# Altium project Nuclear_Briefcase.PrjPcb
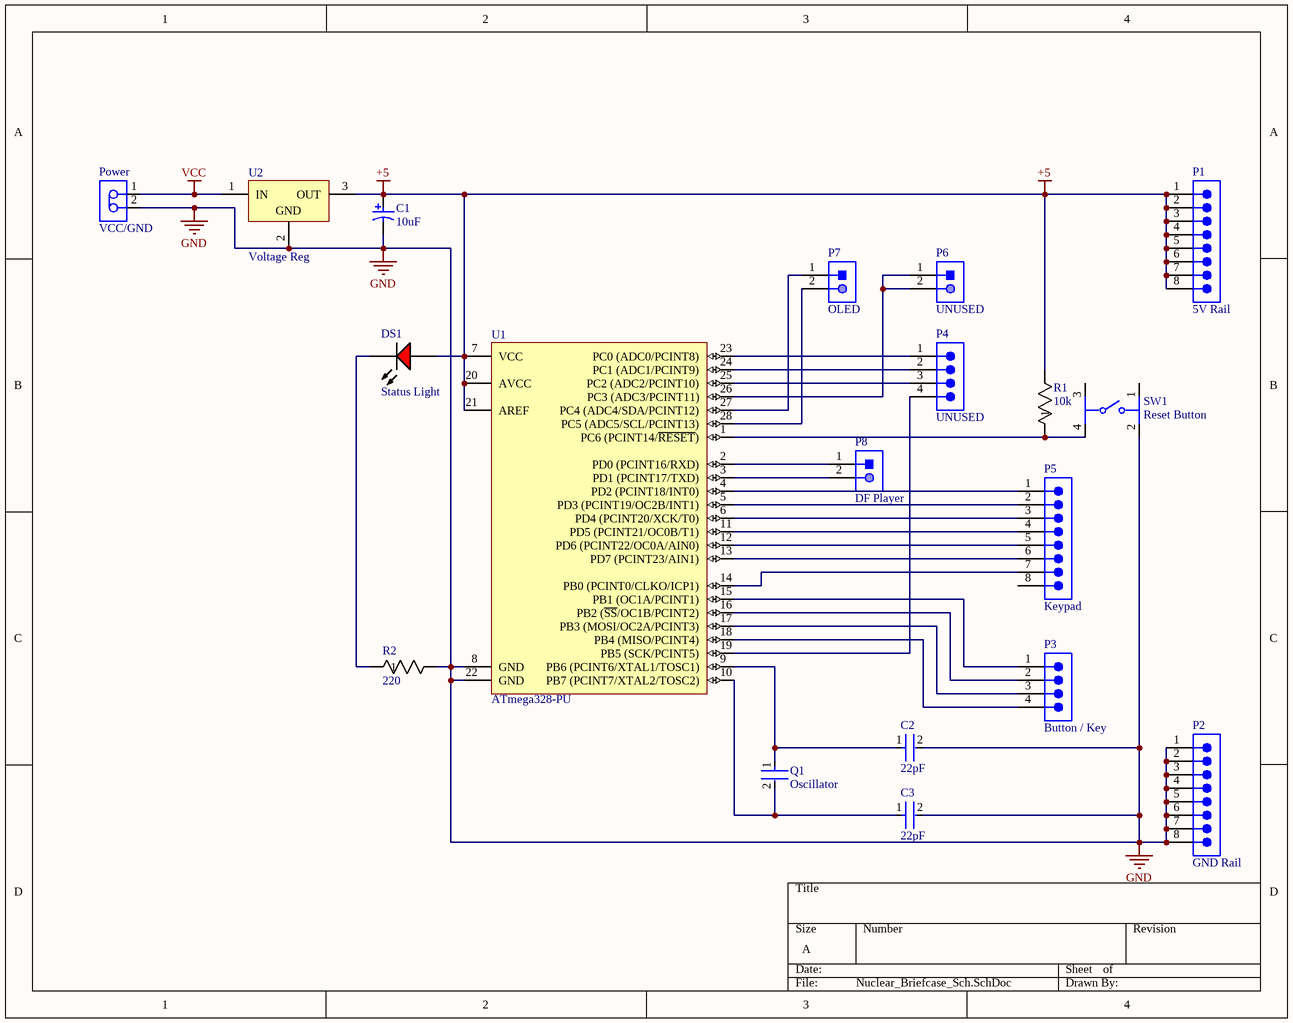
[diagram p0: Nuclear_Briefcase_Sch.SchDoc]
1 sheet, 19 parts. Net scope: global (net labels, ports and power ports of the same name join across sheets).

## Sheet Nuclear_Briefcase_Sch.SchDoc
size A; SheetNumber: 1; SheetTotal: 1

### Parts
C1  10uF  [CAPPR55-200-1100X500X1200]
C2  22pF  [FP-RCE0DB-MFG]
C3  22pF  [FP-RCE0DB-MFG]
DS1  Status Light  [LED-2P-2.28-3MM_A]
P1  5V Rail  [691321300008]
P2  GND Rail  [691321300008]
P3  Button / Key  [61300411121]
P4  UNUSED  [61300411121]
P5  Keypad  [691321300008]
P6  UNUSED  [JST-S2B-XH-A(LF)(SN)_V]
P7  OLED  [JST-S2B-XH-A(LF)(SN)_V]
P8  DF Player  [JST-S2B-XH-A(LF)(SN)_V]
Power  VCC/GND  [TECO-640456-2_V]
Q1  Oscillator  [FP-RCE0DB-MFG]
R1  10k  [RES_AC07_VIS]
R2  220  [RES_AC05_VIS]
SW1  Reset Button  [FP-PTS645SM43SMTR92LFS-MFG]
U1  ATmega328-PU  [28P3]
U2  Voltage Reg  [TO220]

### Nets
+5: C1.1 DS1.1(A) P1.1 P1.2 P1.3 P1.4 P1.5 P1.6 P1.7 P1.8 R1.2 U1.7(VCC) U1.20(AVCC) U1.21(AREF) U2.3(OUT)
GND: C1.2 C2.2 C3.2 P2.1 P2.2 P2.3 P2.4 P2.5 P2.6 P2.7 P2.8 Power.2 R2.2 SW1.2 U1.8(GND) U1.22(GND) U2.2(GND)
VCC: Power.1 U2.1(IN)
NetC2_1: C2.1 Q1.1 U1.9(PB6_(PCINT6/XTAL1/TOSC1))
NetC3_1: C3.1 Q1.2 U1.10(PB7_(PCINT7/XTAL2/TOSC2))
NetDS1_2: DS1.2(K) R2.1
NetP3_1: P3.1 U1.15(PB1_(OC1A/PCINT1))
NetP3_2: P3.2 U1.16(PB2_(~{SS}/OC1B/PCINT2))
NetP3_3: P3.3 U1.17(PB3_(MOSI/OC2A/PCINT3))
NetP3_4: P3.4 U1.18(PB4_(MISO/PCINT4))
NetP4_1: P4.1 U1.23(PC0_(ADC0/PCINT8))
NetP4_2: P4.2 U1.24(PC1_(ADC1/PCINT9))
NetP4_3: P4.3 U1.25(PC2_(ADC2/PCINT10))
NetP4_4: P4.4 U1.19(PB5_(SCK/PCINT5))
NetP5_1: P5.1 U1.4(PD2_(PCINT18/INT0))
NetP5_2: P5.2 U1.5(PD3_(PCINT19/OC2B/INT1))
NetP5_3: P5.3 U1.6(PD4_(PCINT20/XCK/T0))
NetP5_4: P5.4 U1.11(PD5_(PCINT21/OC0B/T1))
NetP5_5: P5.5 U1.12(PD6_(PCINT22/OC0A/AIN0))
NetP5_6: P5.6 U1.13(PD7_(PCINT23/AIN1))
NetP5_7: P5.7 U1.14(PB0_(PCINT0/CLKO/ICP1))
NetP6_1: P6.1 P6.2 U1.26(PC3_(ADC3/PCINT11))
NetP7_1: P7.1 U1.27(PC4_(ADC4/SDA/PCINT12))
NetP7_2: P7.2 U1.28(PC5_(ADC5/SCL/PCINT13))
NetP8_1: P8.1 U1.2(PD0_(PCINT16/RXD))
NetP8_2: P8.2 U1.3(PD1_(PCINT17/TXD))
NetR1_1: R1.1 SW1.4 U1.1(PC6_(PCINT14/~{RESET}))

Not connected (* = marked no-connect by the designer): P5 8; SW1 1 3

### Library data of the parts
C1 = CMP-1665-00038-2: Aluminum Electrolytic Capacitor, 10 uF, +/- 20%, 50 V, -40 to 85 degC, 2-Pin THD, RoHS, Bulk; Manufacturer: Panasonic; Life (Hours): 2000Hour; Lead/Base Style: Straight; Dissipation Factor: 0.12%; Leakage Current: 3uA; Dielectric Material: Aluminium; Lead Diameter: 0.5mm; Voltage Rating: 50V; Ripple Current: 65mA; Package Reference: CAPPR55-200-1100X500X1200; Height: 11mm; Diameter: 5mm; REACH SVHC: NoSVHC; Mount: ThroughHole; Packaging: Bulk; Manufacturer URL: http://www.panasonic.com/; Capacitance: 10uF; Termination: Radial; Datasheet URL: https://industrial.panasonic.com/cdbs/www-data/pdf/RDF0000/ABA0000C1218.pdf; Lead Free: LeadFree; Height - Seated (Max): 0.472inch; Case/Package: Radial; Package Description: 2-Pin Radial Lead, Dia 5 mm, Height 12 mm; Tolerance: 20%; Datasheet Version: Rev. 05, 10/2016; Package Quantity: 200; Ripple Current (AC): 65mA; Min Operating Temperature: -40degC; RoHSCompliant: true; Number of Pins: 2; Max Operating Temperature: 85degC; Voltage: 50V; Lead Pitch: 2mm; Radiation Hardening: No; Voltage Rating (DC): 50V; Length: 11mm
C2 C3 Q1 = CMP-06035-047347-1: Cap Ceramic 22pF 100V C0G ±5% Radial 2.5mm +125°C Ammo Pack; Lead Diameter: 0.5mm; Lead/Base Style: Straight; Height: 3.5mm; Voltage: 100V; Mount: Through Hole; Min Operating Temperature: -55°C; Height - Seated (Max): 0.138inch; Dielectric: C0G; Width: 0.098inch; Depth: 2.5mm; Lead Pitch: 0.098inch; Packaging: Tape and Reel; Voltage Rating (DC): 100V; Capacitance: 22pF; Package Quantity: 2000; Max Operating Temperature: 125°C; Tolerance: 5%; Termination: Radial; Voltage Rating: 100V; Case/Package: Radial; Resistor Type: Ceramic; Length: 3.6mm; Ratings: AEC-Q200
DS1 = CMP-007-00007-2: Red LED, 80 mW, 30 mA, -25 to 85 degC, 2-Pin THD; Manufacturer: Shenzhen CGX; Package Description: 2-Pin Through Hole Device, Dia 3 mm, Pitch 2.28 mm; Datasheet URL: http://datasheet.octopart.com/304090041-Chengguangxing-datasheet-62330656.pdf; Mounting Technology: TH; Manufacturer URL: http://szcgx.com/; RoHS Compliant: Unknown; Datasheet Version: Sep-14; Case/Package: 304090041; Package Reference: 304090041
P1 P2 P5 = CMP-002-00073-1: Barrier Strip Terminal Block, 10A, 1 Row(s), 1 Deck(s); Manufacturer Series: 321; Terminal and Terminal Block Type: BARRIER STRIP TERMINAL BLOCK; RoHS Compliant: Yes; Reach SVHC Compliant: Yes
P3 P4 = CMP-002-00093-1: Board Connector, 4 Contact(s), 1 Row(s), Male, Straight, 0.1 inch Pitch, Solder Terminal, Locking, Black Insulator, Plug; Body Length: 0.4inch; Rated Current (Signal): 3A; Number of Rows Loaded: 1; Reliability: COMMERCIAL; Contact Style: SQ PIN-SKT; Contact Resistance: 20mR; Dielectric Withstanding Voltage (AC): 500V; Contact Pattern: RECTANGULAR; Reference Standard: UL; Insulation Resistance: 1GR; Number of Contacts: 4; Insulation Color: Black; Contact Gender: Male; Mounting Style: STRAIGHT; Body Depth: 0.1inch; Min Operating Temperature: -40°C; Contact Material: Copper Alloy; Number Of Connectors: 1; Mounting Technology: Board; Connector Type: BOARD CONNECTOR; Max Operating Temperature: 125°C; Body/Shell Style: PLUG; Reach SVHC Compliant: Yes; JESD-609 Code: e4; Terminal Pitch: 2.54mm; Contact Finish - Mating: GOLD; Body Breadth: 0.1inch; Mating Contact Pitch: 0.1inch; Terminal Length: 0.118inch; Insulation Material: Polybutylene; Contact Finish - Termination: Gold (Au) - with Nickel (Ni) barrier; Mounting Option 1: LOCKING; PCB Contact Pattern: RECTANGULAR; RoHS Compliant: Yes; Termination: Solder
P6-P8 = CMP-002-00032-2: Male Header, Pitch 2.5 mm, 1 x 2 Position, Height 6.1 mm, Tail Length 3.4 mm, -25 to 85 degC, RoHS, Bulk; Manufacturer: JST; Case/Package: S2B-XH-A(LF)(SN); Package Description: XH Series Disconnectable Crimp Style Connector, Pitch 2.5 mm, 1 x 2 Position, Height 6.1 mm, Tail Length 3.4 mm; Manufacturer URL: http://www.jst.com/home2.html; Datasheet URL: http://www.jst-mfg.com/product/pdf/eng/eXH.pdf; Connector Type: Header; Package Reference: S2B-XH-A(LF)(SN); Mounting Technology: TH; Max Operating Temperature: 85°C; Min Operating Temperature: -25°C; Datasheet Version: May-16; Gender: Male; RoHS Compliant: Unknown
Power = CMP-2000-05417-1: Male Header, Pitch 2.54 mm, 1 x 2 Position, Height 10.49 mm, Tail Length 3.556 mm, -55 to 105 degC, RoHS, Bulk; Manufacturer: TE Connectivity; Standards: RoHSCompliant,ELVCompliant,UL94V-0; Material, Housing: Polyester; Agency Approvals: CSA,UL; Brand/Series: MTA-100Series; Contact Centerline Spacing: 0.100 / in.; Material, Contact: CopperAlloy; Current, Rating: 5 / A; Color, Housing: White; Contact Termination Area Plating: Tin; Special Features: Pinstrip; Number of Positions: 2; Pin Spacing: 0.1 / "; Temperature, Operating: -55to+105 / degC; Angle: Straight; Mount Angle: Vertical; Connector Type: MTA-100; Primary Type: InterconnectSystem; Voltage, Rating: 250 / V; Mounting Hole Size: 0.04 / "; Number of Rows: 1; Termination: Solder; Length, Terminal Post: 0.14 / in.; Manufacturer URL: http://www.te.com/; Color: White; Size, Post: 0.025 / in.; Contact Shape: Square; Mounting Type: PCMount; Datasheet URL: https://datasheet.ciiva.com/11746/0900766b80eb7fdd-11746365.pdf; Type: PCBPlug; Datasheet Version: Rev. W, 06/2004; Number of Contacts: 2; Flammability Rating: UL94V-0; Contact Plating: Tin; Length, Pin: 0.14 / "; Contact Mating Area Plating: Tin; Length, Overall: 0.2 / "
R1 = CMP-00030-42824152-1: AC07000001002JAC00 Resistor, 10 kOhm, ± 5%, 7 W, Axial Leaded, Wirewound, General Purpose; Voltage Rating (DC): 265V; Power Rating: 7W; Temperature Coefficient: 180ppm/°C; Resistance: 10kΩ; Composition: Wirewound; NexarPartId: 42824152; Thickness: 7.493mm; Number of Terminations: 2; Schedule B: 8533210080, 8533210080; Tolerance: 5%; Case/Package: Axial; RoHS: Compliant; Features: Flame Retardant Coating; Max Power Dissipation: 7W; Termination: Axial; Diameter: 7.5mm; Military Standard: Not; Contact Plating: Tin; Max Operating Temperature: 200°C; Width: 7.49mm; Packaging: Tape & Box (TB); Length: 26mm; Number of Pins: 2; Voltage Rating: 265V; Min Operating Temperature: -40°C; REACH SVHC: Unknown
R2 = CMP-00030-39746845-1: AC05000002200JAC00 Resistor, 220 Ohm, ± 5%, 5 W, Axial Leaded, Wirewound, General Purpose; Lead Diameter: 800µm; Resistance: 220Ω; Voltage Rating: 33V; Temperature Coefficient: -10ppm/°C; Power Rating: 5W; Composition: Wirewound; Min Operating Temperature: -40°C; NexarPartId: 39746845; Radiation Hardening: No; Number of Terminations: 2; Military Standard: Not; RoHS: Compliant; REACH SVHC: Unknown; Contact Plating: Tin; Voltage Rating (DC): 33V; Number of Pins: 2; Tolerance: 5%; Schedule B: 8533210080, 8533210080; Features: Flame Retardant Coating; Diameter: 7.5mm; Max Power Dissipation: 5W; Termination: Axial; Max Operating Temperature: 275°C; Width: 7.493mm; Length: 18mm; Packaging: Cut Tape (CT); Case/Package: Conformal
SW1 = CMP-2000-05160-2: SWITCH TACTILE SPST-NO 0.05A 12V; Contact Resistance: 100mR; Throw Configuration: SPST; Illumination Type: Non-Illuminated; Mechanical Life: 100000Cycles; Current Rating: 50mA; Switch Function: Off-Mom; Actuator Length: 0.85mm; Actuator Material: Nylon; Actuator Type: Standard; Operating Force: 160gf; Min Operating Temperature: -20°C; REACH SVHC: No SVHC; Termination: Gull Wing; Case/Package: SMD/SMT; Packaging: Tape and Reel; Mount: Surface Mount; Voltage Rating (DC): 12V; Orientation: Straight; Lead Free: Lead Free; Contact Material: Silver; Color: Black; Max Current Rating: 50mA; Contact Plating: Silver; Depth: 9mm; Package Quantity: 1; Max Voltage Rating (DC): 12V; Length: 6mm; Max Operating Temperature: 60°C
U1 = CMP-0095-00015-2: 8-bit AVR Microcontroller, 32KB Flash, 1KB EEPROM, 2KB SRAM, 28-pin PDIP, Industrial Grade (-40°C to 85°C); ComponentLink3Description: ATmega48A/48PA/88A/88PA/168A/168PA/328/328P Summary; RevisionNote: DatasheetVersion updated. URLs added.; DatasheetVersion: revD, May-2011; ComponentLink1URL: http://www.atmel.com/; PackageVersion: revB, Sep-2001; PackageDescription: 28-lead (0.300"/7.62mm Wide) Plastic Dual Inline Package (PDIP); PackageReference: 28P3; ComponentLink1Description: Manufacturer URL; ComponentLink2Description: ATmega48A/48PA/88A/88PA/168A/168PA/328/328P Datasheet; ComponentLink3URL: http://www.atmel.com/dyn/resources/prod_documents/8271S.pdf; ComponentLink2URL: http://www.atmel.com/dyn/resources/prod_documents/8271.pdf
U2 = CMP-019-00018-3: Positive Voltage Regulator IC, 1.5 A, 5 V, 0 to 125 degC, 3-Pin TO-220, RoHS, Tube; Manufacturer: STMicroelectronics; Max Input Voltage: 35V; Min Supply Voltage: 8V; Nominal Output Voltage: 5V; Outputs: 1; Output Current: 1.5A; Dropout Voltage: 2V; Max Supply Voltage: 20V; Min Input Voltage: 7V; Datasheet Version: Rev 30, 09/2012; Min Operating Temperature: 0°C; Manufacturer URL: http://www.st.com/; Pins: 3; Mounting Technology: TH; Output Voltage: 5V; RoHS Compliant: True; Max Ouput Current: 1.5A; Datasheet URL: https://datasheet.ciiva.com/15111/getdatasheetpartid-44136-15111027.pdf; Packaging: Rail/Tube; Max Operating Temperature: 125°C; Case/Package: TO-220; Package Quantity: 50